# Altium project DD2090_4CAM_FFC_R2M1E2.PrjPcb (part 4 of 5)

## Sheet DD2090_4CAM_FFC_MIPI_4LANE_CAM.SchDoc: =project_title
size Tabloid; PageSetup: Record=PageOptions|CenterHorizontal=True|CenterVertical=True|PrintScale=0.73|XCorrection=1.00|YCorrection=1.00|PrintKind=0|BorderSize=5000000|LeftOffset=0|BottomOffset=0|Orientation=2|PaperLength=1000|PaperWidth=1000|Scale=100|PaperSource=7|PrintQuality=-4|MediaType=1|DitherType=10|PaperKind=A4|PrintScaleMode=1; CompanyName: Luxonis Holding; DrawnBy: Dan Dunga; Organization: Luxonis Holding; Address1: 1925 Harmony Park Drive; Address2: Westminster, CO; Address3: 80234; Address4: United States; DocumentNumber: D0000190; SheetNumber: 6; SheetTotal: 12
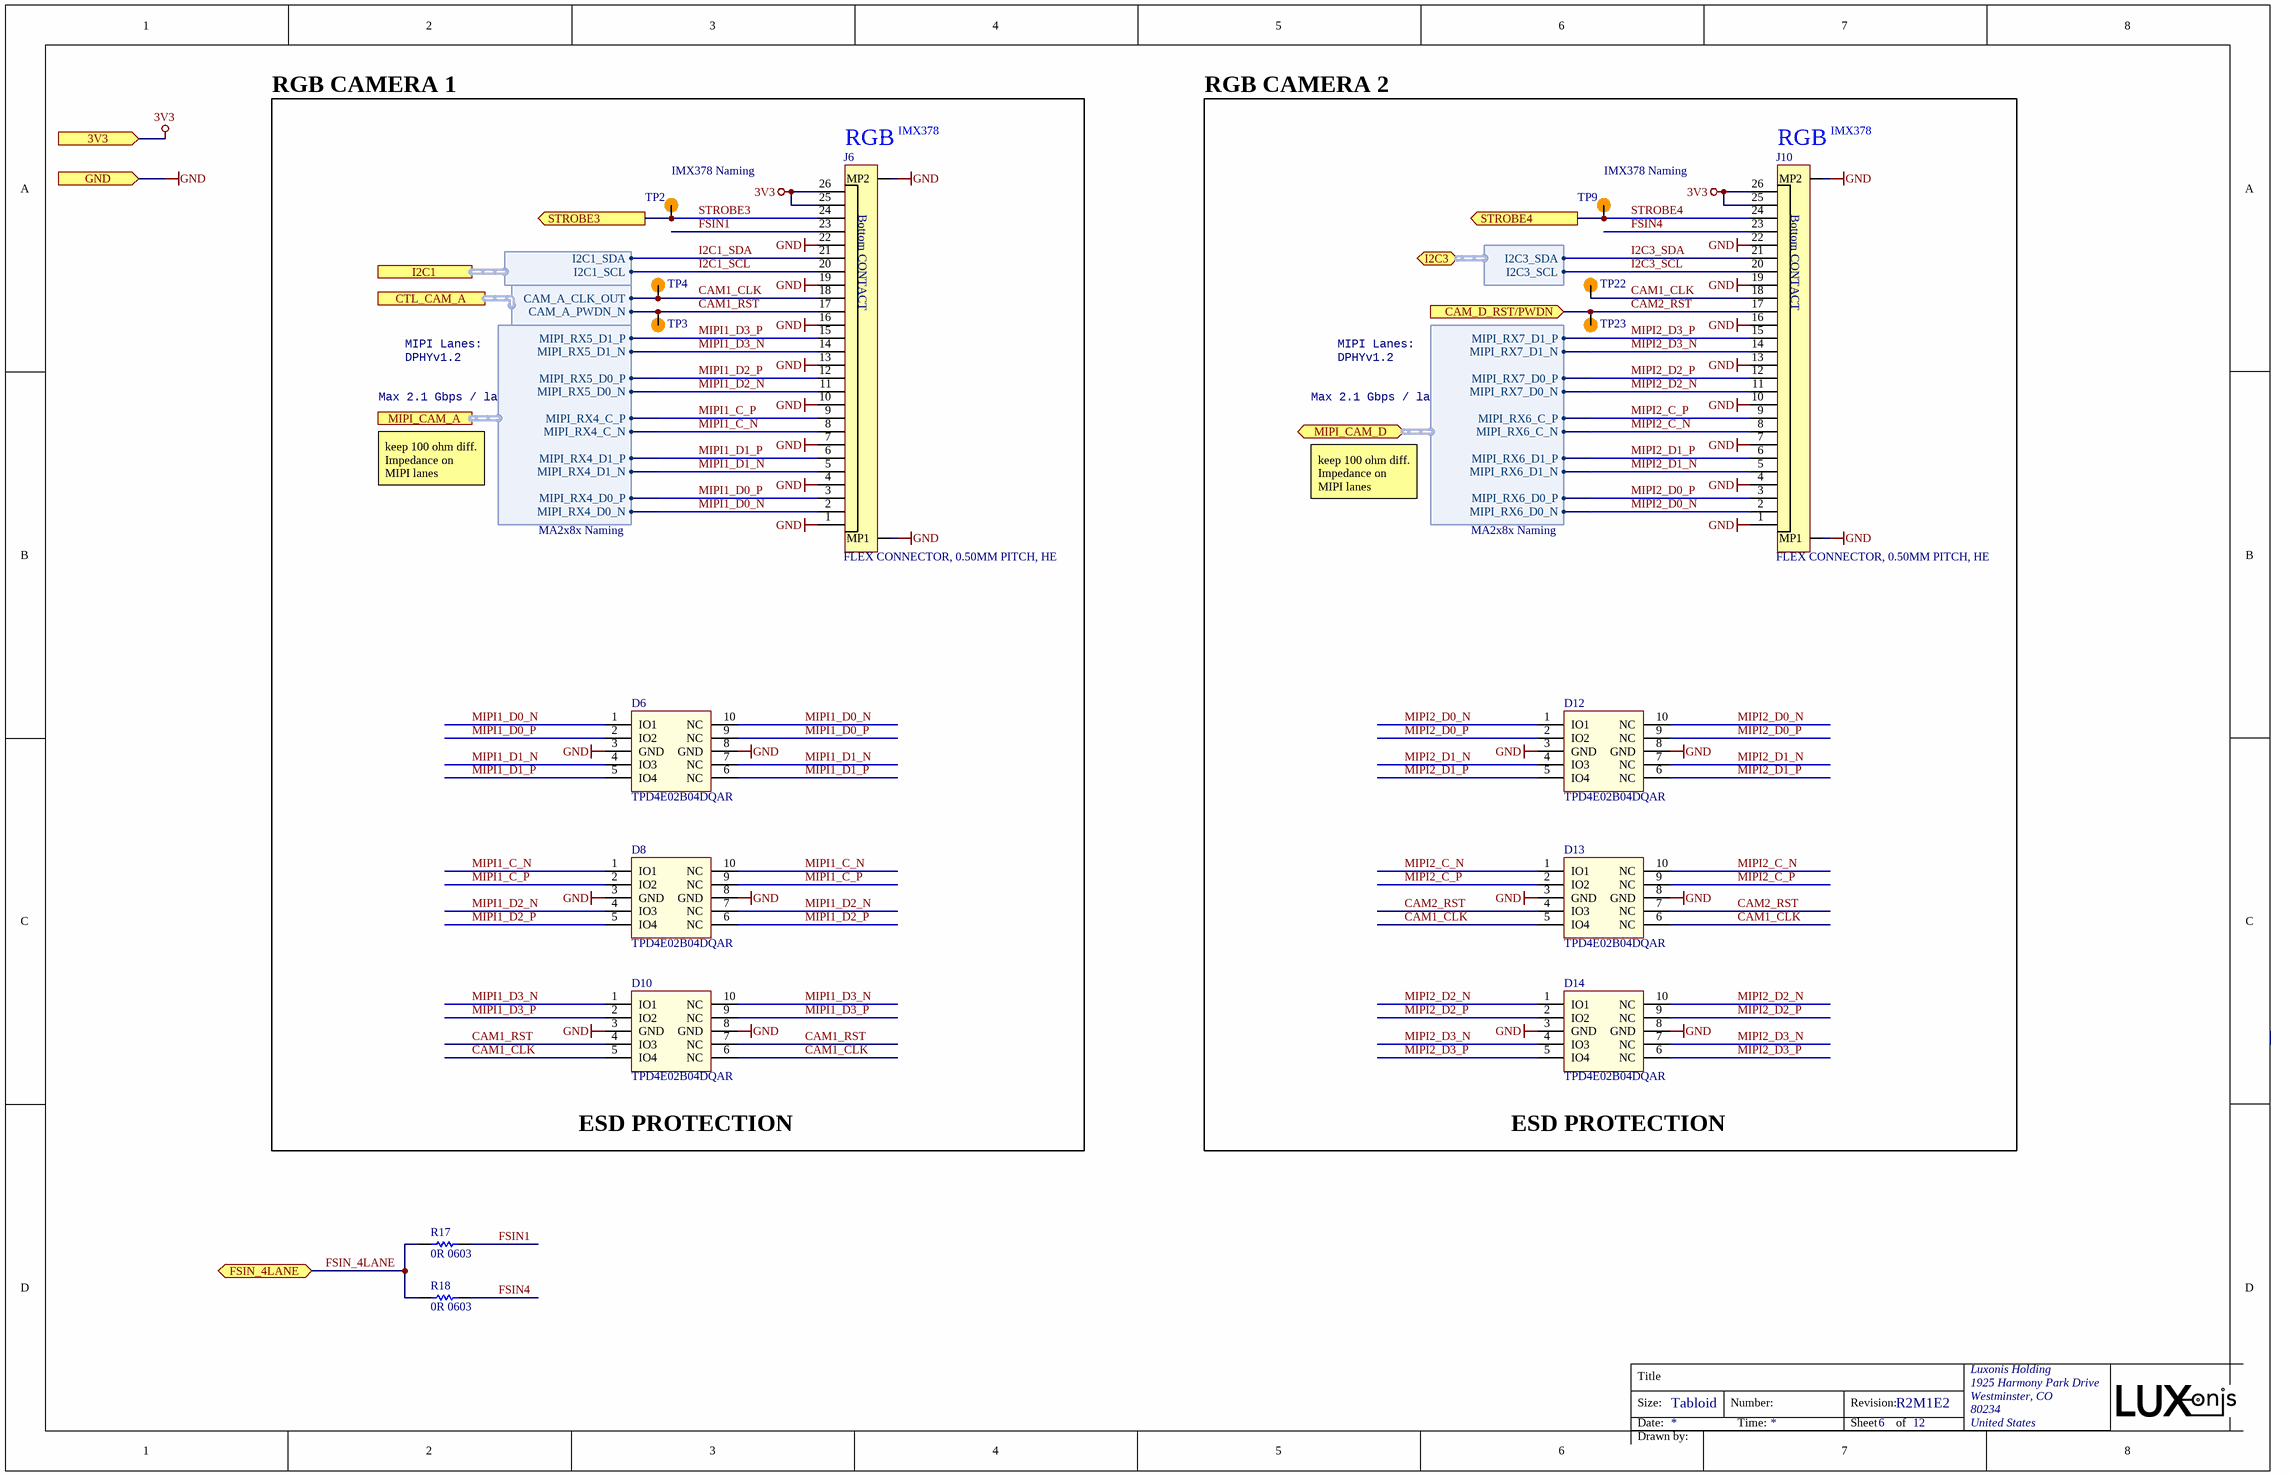
[diagram p7: DD2090_4CAM_FFC_MIPI_4LANE_CAM.SchDoc]

### Parts
D6  TPD4E02B04DQAR  [TPD4E02B04DQAR]
D8  TPD4E02B04DQAR  [TPD4E02B04DQAR]
D10  TPD4E02B04DQAR  [TPD4E02B04DQAR]
D12  TPD4E02B04DQAR  [TPD4E02B04DQAR]
D13  TPD4E02B04DQAR  [TPD4E02B04DQAR]
D14  TPD4E02B04DQAR  [TPD4E02B04DQAR]
J6  FLEX CONNECTOR, 0.50MM PITCH, HE  [F32R-1A7H1-11026]
J10  FLEX CONNECTOR, 0.50MM PITCH, HE  [F32R-1A7H1-11026]
R17  0R 0603  [RESC0603(1608)_N]
R18  0R 0603  [RESC0603(1608)_N]
TP2  TP100_200_NS  [TP100_200_NS]  (value not drawn)  (no BOM)
TP3  TP100_200_NS  [TP100_200_NS]  (value not drawn)  (no BOM)
TP4  TP100_200_NS  [TP100_200_NS]  (value not drawn)  (no BOM)
TP9  TP100_200_NS  [TP100_200_NS]  (value not drawn)  (no BOM)
TP22  TP100_200_NS  [TP100_200_NS]  (value not drawn)  (no BOM)
TP23  TP100_200_NS  [TP100_200_NS]  (value not drawn)  (no BOM)

### Ports
3V3 (in), CAM_D_RST/PWDN (in), CTL_CAM_A (harness CTL_CAM_A), FSIN_4LANE (bidir), GND (in), I2C1 (harness I2C1), I2C3 (bidir, harness I2C3), MIPI_CAM_A (harness MIPI_CAM_A), MIPI_CAM_D (bidir, harness MIPI_CAM_D), STROBE3 (out), STROBE4 (out)

### Harnesses
I2C1: I2C1_SDA, I2C1_SCL
MIPI_CAM_A: MIPI_RX5_D0_P, MIPI_RX5_D0_N, MIPI_RX4_D0_P, MIPI_RX4_D0_N, MIPI_RX4_C_P, MIPI_RX4_C_N, MIPI_RX4_D1_N, MIPI_RX4_D1_P, MIPI_RX5_D1_P, MIPI_RX5_D1_N
CTL_CAM_A: CAM_A_PWDN_N, CAM_A_CLK_OUT
MIPI_CAM_D: MIPI_RX6_C_N, MIPI_RX6_C_P, MIPI_RX6_D0_N, MIPI_RX6_D0_P, MIPI_RX6_D1_N, MIPI_RX6_D1_P, MIPI_RX7_D0_N, MIPI_RX7_D0_P, MIPI_RX7_D1_N, MIPI_RX7_D1_P
I2C3: I2C3_SCL, I2C3_SDA

### Nets
3V3: J6.25 J6.26 J10.25 J10.26 ; port 3V3
GND: D6.3(GND) D6.8(GND) D8.3(GND) D8.8(GND) D10.3(GND) D10.8(GND) D12.3(GND) D12.8(GND) D13.3(GND) D13.8(GND) D14.3(GND) D14.8(GND) J6.1 J6.4 J6.7 J6.10 J6.13 J6.16 J6.19 J6.22 J6.MP1 J6.MP2 J10.1 J10.4 J10.7 J10.10 J10.13 J10.16 J10.19 J10.22 J10.MP1 J10.MP2 ; port GND
CAM1_CLK: D10.5(IO4) D10.6(NC) D13.5(IO4) D13.6(NC) J6.18 J10.18 TP4.1 TP22.1 ; port CTL_CAM_A.CAM_A_CLK_OUT
CAM1_RST: D10.4(IO3) D10.7(NC) J6.17 TP3.1 ; port CTL_CAM_A.CAM_A_PWDN_N
CAM2_RST: D13.4(IO3) D13.7(NC) J10.17 TP23.1 ; port CAM_D_RST/PWDN
FSIN1: J6.23 R17.2
FSIN4: J10.23 R18.2
FSIN_4LANE: R17.1 R18.1 ; port FSIN_4LANE
I2C1_SCL: J6.20 ; port I2C1.I2C1_SCL
I2C1_SDA: J6.21 ; port I2C1.I2C1_SDA
I2C3_SCL: J10.20 ; port I2C3.I2C3_SCL
I2C3_SDA: J10.21 ; port I2C3.I2C3_SDA
MIPI1_C_N: D8.1(IO1) D8.10(NC) J6.8 ; port MIPI_CAM_A.MIPI_RX4_C_N
MIPI1_C_P: D8.2(IO2) D8.9(NC) J6.9 ; port MIPI_CAM_A.MIPI_RX4_C_P
MIPI1_D0_N: D6.1(IO1) D6.10(NC) J6.2 ; port MIPI_CAM_A.MIPI_RX4_D0_N
MIPI1_D0_P: D6.2(IO2) D6.9(NC) J6.3 ; port MIPI_CAM_A.MIPI_RX4_D0_P
MIPI1_D1_N: D6.4(IO3) D6.7(NC) J6.5 ; port MIPI_CAM_A.MIPI_RX4_D1_N
MIPI1_D1_P: D6.5(IO4) D6.6(NC) J6.6 ; port MIPI_CAM_A.MIPI_RX4_D1_P
MIPI1_D2_N: D8.4(IO3) D8.7(NC) J6.11 ; port MIPI_CAM_A.MIPI_RX5_D0_N
MIPI1_D2_P: D8.5(IO4) D8.6(NC) J6.12 ; port MIPI_CAM_A.MIPI_RX5_D0_P
MIPI1_D3_N: D10.1(IO1) D10.10(NC) J6.14 ; port MIPI_CAM_A.MIPI_RX5_D1_N
MIPI1_D3_P: D10.2(IO2) D10.9(NC) J6.15 ; port MIPI_CAM_A.MIPI_RX5_D1_P
MIPI2_C_N: D13.1(IO1) D13.10(NC) J10.8 ; port MIPI_CAM_D.MIPI_RX6_C_N
MIPI2_C_P: D13.2(IO2) D13.9(NC) J10.9 ; port MIPI_CAM_D.MIPI_RX6_C_P
MIPI2_D0_N: D12.1(IO1) D12.10(NC) J10.2 ; port MIPI_CAM_D.MIPI_RX6_D0_N
MIPI2_D0_P: D12.2(IO2) D12.9(NC) J10.3 ; port MIPI_CAM_D.MIPI_RX6_D0_P
MIPI2_D1_N: D12.4(IO3) D12.7(NC) J10.5 ; port MIPI_CAM_D.MIPI_RX6_D1_N
MIPI2_D1_P: D12.5(IO4) D12.6(NC) J10.6 ; port MIPI_CAM_D.MIPI_RX6_D1_P
MIPI2_D2_N: D14.1(IO1) D14.10(NC) J10.11 ; port MIPI_CAM_D.MIPI_RX7_D0_N
MIPI2_D2_P: D14.2(IO2) D14.9(NC) J10.12 ; port MIPI_CAM_D.MIPI_RX7_D0_P
MIPI2_D3_N: D14.4(IO3) D14.7(NC) J10.14 ; port MIPI_CAM_D.MIPI_RX7_D1_N
MIPI2_D3_P: D14.5(IO4) D14.6(NC) J10.15 ; port MIPI_CAM_D.MIPI_RX7_D1_P
STROBE3: J6.24 TP2.1 ; port STROBE3
STROBE4: J10.24 TP9.1 ; port STROBE4

### Notes on the sheet
- RGB CAMERA 1
- RGB CAMERA 2
- (near J6) RGB
- (near J6) IMX378
- (near J10) RGB
- (near J10) IMX378
- (near TP2) IMX378 Naming
- (near TP9) IMX378 Naming
- MIPI Lanes:
- DPHYv1.2
- Max 2.1 Gbps / lane
- keep 100 ohm diff. Impedance on MIPI lanes
- MA2x8x Naming
- ESD PROTECTION
- Title
- Size:
- Date:
- Tabloid
- Number:
- Time:
- Revision:
- Sheet
- of
- Drawn by:
- (in symbol F32R-1A7H1-11026) Bottom CONTACT

### Library data of the parts
D6 D8 D10 D12-D14 = TPD4E02B04DQAR: TVS DIODE 3.6V 8.8V 10USON 8.8V (Typ) Clamp 5A (8/20µs) Ipp Tvs Diode Surface Mount 10-USON (2.5x1); Manufacturer 1: Texas Instruments; Number of Bidirectional Channels: 4; Min Breakdown Voltage: 5.5V; Peak Pulse Power: 17W; Power Line Protection: No; Interface: USB,HDMI; Supplier 1: Digi-Key; Manufacturer Part Number 1: TPD4E02B04DQAR; Stock 1: 25615; Pricing 1: 1=0.69000, 10=0.60800, 100=0.46650, 500=0.36874, 1000=0.29499 (USD); RoHS: Yes; Mount: Surface Mount; Number of Pins: 10; Min Operating Temperature: -40°C; Max Operating Temperature: 125°C; Packaging: Cut Tape; Reverse Standoff Voltage: 3.6V; Clamping Voltage: 8.8V; Operating Supply Voltage: 3.6V; Peak Pulse Current: 5A; Number of Channels: 4; Composition: Zener; REACH SVHC: No SVHC; Lead Free: Lead Free; ComponentLink1URL: http://www.ti.com/general/docs/lit/getliterature.tsp?genericPartNumber=TPD4E02B04&amp;&amp;fileType=pdf&src-supplier=Element14; ComponentLink1Description: http://www.ti.com/general/docs/lit/getliterature.tsp?genericPartNumber=TPD4E02B04&amp;&amp;fileType=pdf&src-supplier=Element14; ComponentLink2URL: http://www.ti.com/lit/ds/symlink/tpd4e02b04.pdf?src-supplier=Farnell; ComponentLink2Description: http://www.ti.com/lit/ds/symlink/tpd4e02b04.pdf?src-supplier=Farnell; ComponentLink3URL: http://www.ti.com/lit/ds/symlink/tpd4e02b04.pdf?src-supplier=Newark; ComponentLink3Description: http://www.ti.com/lit/ds/symlink/tpd4e02b04.pdf?src-supplier=Newark; ComponentLink4URL: http://www.ti.com/lit/ds/symlink/tpd4e02b04.pdf?src-supplier=Digi-Key; ComponentLink4Description: http://www.ti.com/lit/ds/symlink/tpd4e02b04.pdf?src-supplier=Digi-Key; Supplier Part Number 1: 296-43875-1-ND
J6 J10 = F32R-1A7H1-11026: 26 Position FFC, FPC Connector Contacts, Bottom 0.020" (0.50mm) Surface Mount, Right Angle; Manufacturer 1: Amphenol ICC (FCI); Number of Positions: 26; Voltage Rating: 50V; Current Rating: 500mA; Pitch: 0.02inch; Supplier 1: Digi-Key; Manufacturer Part Number 1: F32R-1A7H1-11026; RoHS: Yes; Category: Connectors; Pricing 1: 1=0.77, 10=0.721, 100=0.5529, 500=0.4808 (USD); Mount: Surface Mount; Contact Plating: Tin; Contact Material: Bronze; Min Operating Temperature: -40°C; Max Operating Temperature: 105°C; Packaging: Tape and Reel; Termination: Solder; Flammability Rating: UL94 V-0; ComponentLink1URL: https://cdn.amphenol-icc.com/media/wysiwyg/files/drawing/f32r-f32j.pdf; ComponentLink1Description: https://cdn.amphenol-icc.com/media/wysiwyg/files/drawing/f32r-f32j.pdf; Stock 1: 1709; Supplier Part Number 1: 609-F32R-1A7H1-11026CT-ND
R17 R18 = CRCW06030000Z0EA: as R6 on sheet DD2090_4CAM_FFC_Power_Supply; Supplier 1: Digi-Key; Stock 1: 742743; Pricing 1: 1=0.100000, 10=0.034000, 25=0.024400, 50=0.018600, 100=0.013800, 250=0.010480, 500=0.008400, 1000=0.006180 (USD); RoHS: Yes; Mount: Surface Mount; Case/Package: 0603; Weight: 7.1E-05oz; Contact Plating: Tin,Lead; Case Code (Metric): 1608; Case Code (Imperial): 0603; Min Operating Temperature: -55°C; Max Operating Temperature: 155°C; Composition: Thick Film; Termination: SMD/SMT; Packaging: Tape and Reel; Package Quantity: 1; Number of Terminations: 2; Military Standard: Not; Max Power Dissipation: 100mW; Voltage Rating (DC): 75V; Features: Automotive AEC-Q200; Working Voltage: 75V; Length: 1.55mm; Height: 0.02inch; Width: 0.033inch; Depth: 0.85mm; Radiation Hardening: No; Lead Free: Lead Free; REACH SVHC: Unknown; ComponentLink1URL: https://datasheet.ciiva.com/2461/dcrcwe3-2461968.pdf?src-supplier=Digi-Key; ComponentLink1Description: https://datasheet.ciiva.com/2461/dcrcwe3-2461968.pdf?src-supplier=Digi-Key; ComponentLink2URL: https://datasheet.ciiva.com/2461/dcrcwe3-2461969.pdf?src-supplier=Digi-Key; ComponentLink2Description: https://datasheet.ciiva.com/2461/dcrcwe3-2461969.pdf?src-supplier=Digi-Key; ComponentLink3URL: https://datasheet.ciiva.com/2461/dcrcwe3-2461970.pdf?src-supplier=Digi-Key; ComponentLink3Description: https://datasheet.ciiva.com/2461/dcrcwe3-2461970.pdf?src-supplier=Digi-Key; ComponentLink4URL: https://datasheet.ciiva.com/8340/dcrcwe3-8340197.pdf?src-supplier=Avnet; ComponentLink4Description: https://datasheet.ciiva.com/8340/dcrcwe3-8340197.pdf?src-supplier=Avnet; ComponentLink5URL: https://datasheet.ciiva.com/16941/dcrcw-16941302.pdf?src-supplier=Avnet+Europe; ComponentLink5Description: https://datasheet.ciiva.com/16941/dcrcw-16941302.pdf?src-supplier=Avnet+Europe; ComponentLink6URL: https://datasheet.ciiva.com/16199/dcrcwe3-16199063.pdf?src-supplier=Future+Electronics; ComponentLink6Description: https://datasheet.ciiva.com/16199/dcrcwe3-16199063.pdf?src-supplier=Future+Electronics; ComponentLink7URL: https://datasheet.ciiva.com/16725/70201119-16725175.pdf?src-supplier=Allied+Electronics; ComponentLink7Description: https://datasheet.ciiva.com/16725/70201119-16725175.pdf?src-supplier=Allied+Electronics; ComponentLink8URL: https://datasheet.ciiva.com/26316/fld-crcw-e3-data-en-26316615.pdf?src-supplier=Distrelec; ComponentLink8Description: https://datasheet.ciiva.com/26316/fld-crcw-e3-data-en-26316615.pdf?src-supplier=Distrelec; ComponentLink9URL: https://datasheet.ciiva.com/5544/dcrcwe3-109170-5544344.pdf?src-supplier=Mouser; ComponentLink9Description: https://datasheet.ciiva.com/5544/dcrcwe3-109170-5544344.pdf?src-supplier=Mouser; ComponentLink10URL: https://datasheet.ciiva.com/7841/1720486-7841816.pdf?src-supplier=Element14; ComponentLink10Description: https://datasheet.ciiva.com/7841/1720486-7841816.pdf?src-supplier=Element14; ComponentLink11URL: https://datasheet.ciiva.com/7841/1720486-7841817.pdf?src-supplier=Element14; ComponentLink11Description: https://datasheet.ciiva.com/7841/1720486-7841817.pdf?src-supplier=Element14; ComponentLink12URL: https://datasheet.ciiva.com/7841/125364-7841818.pdf?src-supplier=Element14; ComponentLink12Description: https://datasheet.ciiva.com/7841/125364-7841818.pdf?src-supplier=Element14; ComponentLink13URL: https://datasheet.ciiva.com/16721/70201119-16721450.pdf?src-supplier=Allied+Electronics; ComponentLink13Description: https://datasheet.ciiva.com/16721/70201119-16721450.pdf?src-supplier=Allied+Electronics; Supplier Part Number 1: 541-0.0GCT-ND
TP2-TP4 TP9 TP22 TP23 = TEST_POINT

## Sheet DD2090_4CAM_FFC_Connector_A.SchDoc: =project_title
size Tabloid; CompanyName: Luxonis Holding; DrawnBy: Dan Dunga; Organization: Luxonis Holding; Address1: 1925 Harmony Park Drive; Address2: Westminster, CO; Address3: 80234; Address4: United States; DocumentNumber: D0000190; SheetNumber: 3; SheetTotal: 12
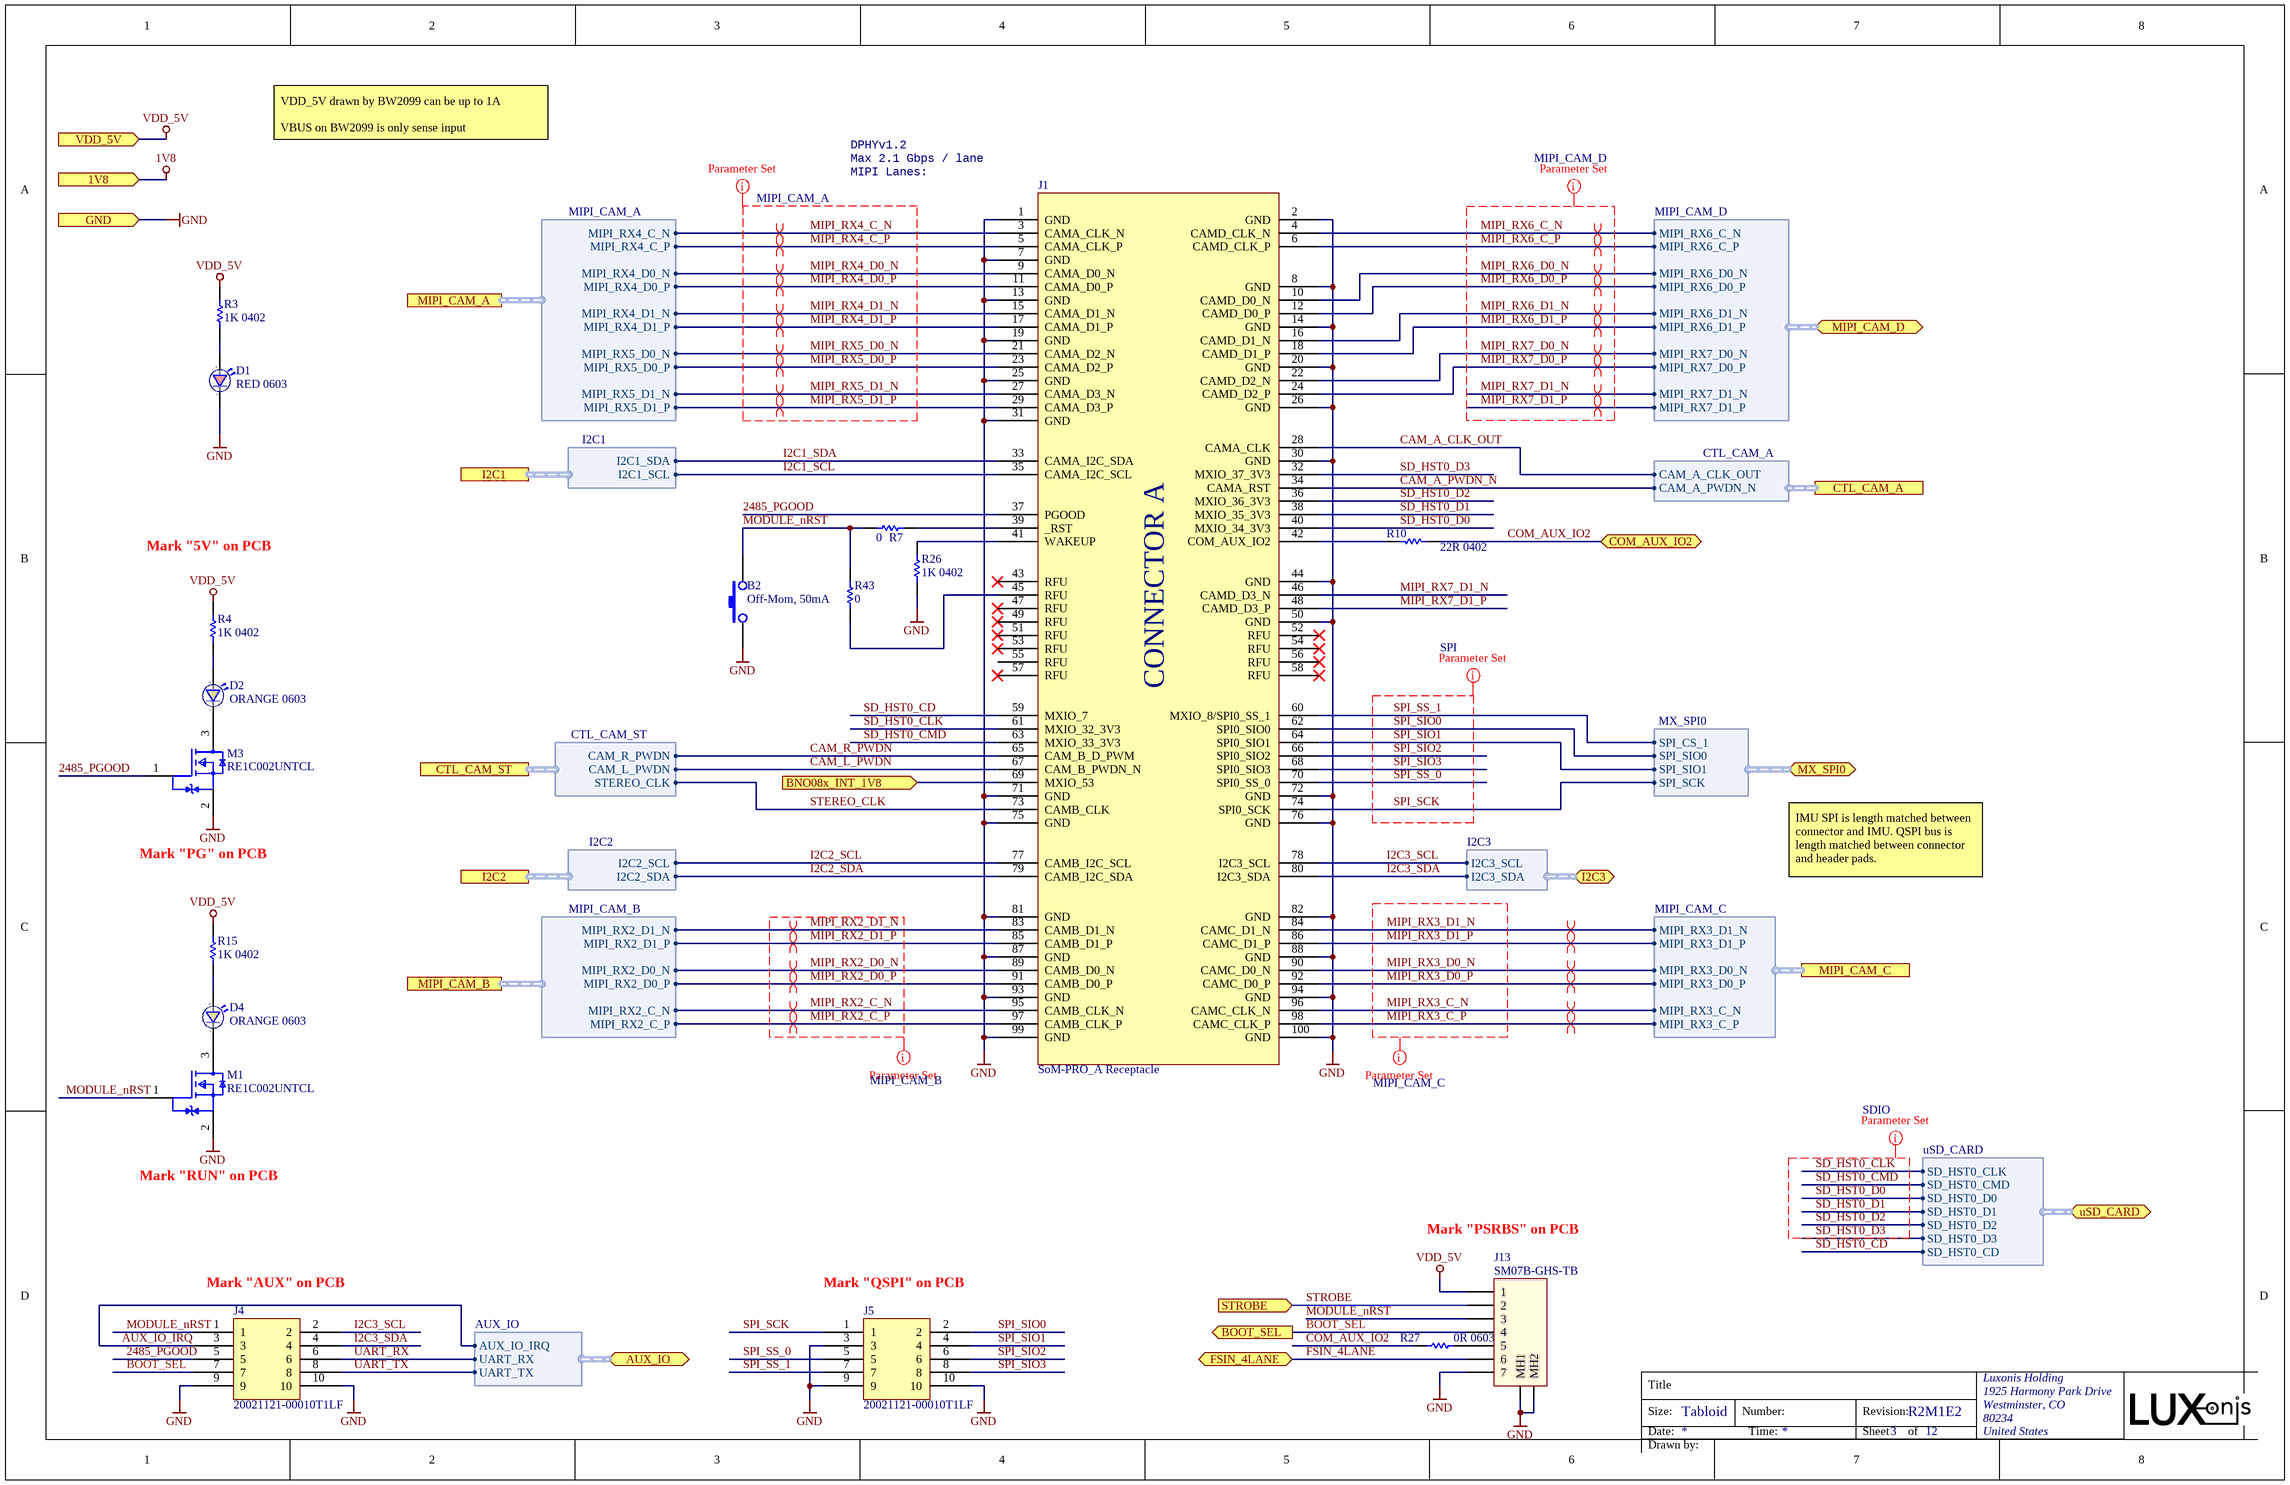
[diagram p8: DD2090_4CAM_FFC_Connector_A.SchDoc]

### Parts
B2  Off-Mom, 50mA  [DTSM-32N-V]
D1  RED 0603  [SML_D1xx8W]
D2  ORANGE 0603  [SML_D1xx8W]
D4  ORANGE 0603  [SML_D1xx8W]
J1  SoM-PRO_A Receptacle  [CON_A_BW2099_SoM_DF40HC-3.0-100DS-0.4V_minpad]
J4  20021121-00010T1LF  [20021121-00010T1LF]
J5  20021121-00010T1LF  [20021121-00010T1LF]
J13  SM07B-GHS-TB  [SM07B-GHS-TB]
M1  RE1C002UNTCL  [RE1C002UNTCL]
M3  RE1C002UNTCL  [RE1C002UNTCL]
R3  1K 0402  [RESC0402(1005)_N]
R4  1K 0402  [RESC0402(1005)_N]
R7  value 0  [RESC0402(1005)_L]  (hidden comment: CRCW04020000Z0ED)
R10  22R 0402  [RESC0402(1005)_N]
R15  1K 0402  [RESC0402(1005)_N]
R26  1K 0402  [RESC0402(1005)_N]
R27  0R 0603  [RESC0603(1608)_N]
R43  value 0  [RESC0402(1005)_L]  (hidden comment: CRCW04020000Z0ED)

### Ports
1V8 (in), AUX_IO (bidir, harness AUX_IO), BNO08x_INT_1V8 (in), BOOT_SEL (out), COM_AUX_IO2 (bidir), CTL_CAM_A (harness CTL_CAM_A), CTL_CAM_ST (harness CTL_CAM_ST), FSIN_4LANE (bidir), GND (in), I2C1 (harness I2C1), I2C2 (harness I2C2), I2C3 (bidir, harness I2C3), MIPI_CAM_A (harness MIPI_CAM_A), MIPI_CAM_B (harness MIPI_CAM_B), MIPI_CAM_C (harness MIPI_CAM_C), MIPI_CAM_D (bidir, harness MIPI_CAM_D), MX_SPI0 (bidir, harness MX_SPI0), STROBE (in), uSD_CARD (bidir, harness uSD_CARD), VDD_5V (in)

### Harnesses
MIPI_CAM_A: MIPI_RX4_C_P, MIPI_RX4_C_N, MIPI_RX4_D0_P, MIPI_RX4_D0_N, MIPI_RX4_D1_P, MIPI_RX4_D1_N, MIPI_RX5_D0_P, MIPI_RX5_D0_N, MIPI_RX5_D1_P, MIPI_RX5_D1_N
I2C1: I2C1_SDA, I2C1_SCL
MIPI_CAM_B: MIPI_RX2_C_P, MIPI_RX2_C_N, MIPI_RX2_D0_P, MIPI_RX2_D0_N, MIPI_RX2_D1_P, MIPI_RX2_D1_N
MIPI_CAM_C: MIPI_RX3_C_P, MIPI_RX3_C_N, MIPI_RX3_D0_P, MIPI_RX3_D0_N, MIPI_RX3_D1_P, MIPI_RX3_D1_N
MX_SPI0: SPI_SIO0, SPI_SIO1, SPI_CS_1, SPI_SCK
CTL_CAM_A: CAM_A_PWDN_N, CAM_A_CLK_OUT
MIPI_CAM_D: MIPI_RX6_C_N, MIPI_RX6_C_P, MIPI_RX6_D0_N, MIPI_RX6_D0_P, MIPI_RX6_D1_N, MIPI_RX6_D1_P, MIPI_RX7_D0_N, MIPI_RX7_D0_P, MIPI_RX7_D1_N, MIPI_RX7_D1_P
uSD_CARD: SD_HST0_CLK, SD_HST0_CMD, SD_HST0_D0, SD_HST0_D1, SD_HST0_D2, SD_HST0_D3, SD_HST0_CD
I2C2: I2C2_SDA, I2C2_SCL
I2C3: I2C3_SCL, I2C3_SDA
AUX_IO: AUX_IO_IRQ, UART_TX, UART_RX
CTL_CAM_ST: CAM_L_PWDN, STEREO_CLK, CAM_R_PWDN

### Nets
GND: B2.1 D1.1(C) J1.1(GND) J1.2(GND) J1.7(GND) J1.8(GND) J1.13(GND) J1.14(GND) J1.19(GND) J1.20(GND) J1.25(GND) J1.26(GND) J1.30(GND) J1.31(GND) J1.44(GND) J1.50(GND) J1.71(GND) J1.72(GND) J1.75(GND) J1.76(GND) J1.81(GND) J1.82(GND) J1.87(GND) J1.88(GND) J1.93(GND) J1.94(GND) J1.99(GND) J1.100(GND) J4.9 J4.10 J5.3 J5.9 J5.10 J13.7 J13.MH1 J13.MH2 M1.2(Source) M3.2(Source) R26.1 ; port GND
VDD_5V: J13.1 R3.2 R4.2 R15.2 ; port VDD_5V
2485_PGOOD: J1.37(PGOOD) J4.5 M3.1(Gate)
AUX_IO_IRQ: J4.3 ; port AUX_IO.AUX_IO_IRQ
BNO08x_INT_1V8: J1.69(MXIO_53) ; port BNO08x_INT_1V8
BOOT_SEL: J4.7 J13.4 ; port BOOT_SEL
CAM_A_CLK_OUT: J1.28(CAMA_CLK) ; port CTL_CAM_A.CAM_A_CLK_OUT  [project net CAM1_CLK]
CAM_A_PWDN_N: J1.34(CAMA_RST) ; port CTL_CAM_A.CAM_A_PWDN_N  [project net CAM1_RST]
CAM_L_PWDN: J1.67(CAM_B_PWDN_N) ; port CTL_CAM_ST.CAM_L_PWDN
CAM_R_PWDN: J1.65(CAM_B_D_PWM) ; port CTL_CAM_ST.CAM_R_PWDN
COM_AUX_IO2: R10.1 R27.1 ; port COM_AUX_IO2
FSIN_4LANE: J13.6 ; port FSIN_4LANE
I2C1_SCL: J1.35(CAMA_I2C_SCL) ; port I2C1.I2C1_SCL
I2C1_SDA: J1.33(CAMA_I2C_SDA) ; port I2C1.I2C1_SDA
I2C2_SCL: J1.77(CAMB_I2C_SCL) ; port I2C2.I2C2_SCL
I2C2_SDA: J1.79(CAMB_I2C_SDA) ; port I2C2.I2C2_SDA
I2C3_SCL: J1.78(I2C3_SCL) J4.2 ; port I2C3.I2C3_SCL
I2C3_SDA: J1.80(I2C3_SDA) J4.4 ; port I2C3.I2C3_SDA
MIPI_RX2_C_N: J1.95(CAMB_CLK_N) ; port MIPI_CAM_B.MIPI_RX2_C_N  [project net CAM_L_C_N]
MIPI_RX2_C_P: J1.97(CAMB_CLK_P) ; port MIPI_CAM_B.MIPI_RX2_C_P  [project net CAM_L_C_P]
MIPI_RX2_D0_N: J1.89(CAMB_D0_N) ; port MIPI_CAM_B.MIPI_RX2_D0_N  [project net CAM_L_D0_N]
MIPI_RX2_D0_P: J1.91(CAMB_D0_P) ; port MIPI_CAM_B.MIPI_RX2_D0_P  [project net CAM_L_D0_P]
MIPI_RX2_D1_N: J1.83(CAMB_D1_N) ; port MIPI_CAM_B.MIPI_RX2_D1_N  [project net CAM_L_D1_N]
MIPI_RX2_D1_P: J1.85(CAMB_D1_P) ; port MIPI_CAM_B.MIPI_RX2_D1_P  [project net CAM_L_D1_P]
MIPI_RX3_C_N: J1.96(CAMC_CLK_N) ; port MIPI_CAM_C.MIPI_RX3_C_N  [project net CAM_R_C_N]
MIPI_RX3_C_P: J1.98(CAMC_CLK_P) ; port MIPI_CAM_C.MIPI_RX3_C_P  [project net CAM_R_C_P]
MIPI_RX3_D0_N: J1.90(CAMC_D0_N) ; port MIPI_CAM_C.MIPI_RX3_D0_N  [project net CAM_R_D0_N]
MIPI_RX3_D0_P: J1.92(CAMC_D0_P) ; port MIPI_CAM_C.MIPI_RX3_D0_P  [project net CAM_R_D0_P]
MIPI_RX3_D1_N: J1.84(CAMC_D1_N) ; port MIPI_CAM_C.MIPI_RX3_D1_N  [project net CAM_R_D1_N]
MIPI_RX3_D1_P: J1.86(CAMC_D1_P) ; port MIPI_CAM_C.MIPI_RX3_D1_P  [project net CAM_R_D1_P]
MIPI_RX4_C_N: J1.3(CAMA_CLK_N) ; port MIPI_CAM_A.MIPI_RX4_C_N  [project net MIPI1_C_N]
MIPI_RX4_C_P: J1.5(CAMA_CLK_P) ; port MIPI_CAM_A.MIPI_RX4_C_P  [project net MIPI1_C_P]
MIPI_RX4_D0_N: J1.9(CAMA_D0_N) ; port MIPI_CAM_A.MIPI_RX4_D0_N  [project net MIPI1_D0_N]
MIPI_RX4_D0_P: J1.11(CAMA_D0_P) ; port MIPI_CAM_A.MIPI_RX4_D0_P  [project net MIPI1_D0_P]
MIPI_RX4_D1_N: J1.15(CAMA_D1_N) ; port MIPI_CAM_A.MIPI_RX4_D1_N  [project net MIPI1_D1_N]
MIPI_RX4_D1_P: J1.17(CAMA_D1_P) ; port MIPI_CAM_A.MIPI_RX4_D1_P  [project net MIPI1_D1_P]
MIPI_RX5_D0_N: J1.21(CAMA_D2_N) ; port MIPI_CAM_A.MIPI_RX5_D0_N  [project net MIPI1_D2_N]
MIPI_RX5_D0_P: J1.23(CAMA_D2_P) ; port MIPI_CAM_A.MIPI_RX5_D0_P  [project net MIPI1_D2_P]
MIPI_RX5_D1_N: J1.27(CAMA_D3_N) ; port MIPI_CAM_A.MIPI_RX5_D1_N  [project net MIPI1_D3_N]
MIPI_RX5_D1_P: J1.29(CAMA_D3_P) ; port MIPI_CAM_A.MIPI_RX5_D1_P  [project net MIPI1_D3_P]
MIPI_RX6_C_N: J1.4(CAMD_CLK_N) ; port MIPI_CAM_D.MIPI_RX6_C_N  [project net MIPI2_C_N]
MIPI_RX6_C_P: J1.6(CAMD_CLK_P) ; port MIPI_CAM_D.MIPI_RX6_C_P  [project net MIPI2_C_P]
MIPI_RX6_D0_N: J1.10(CAMD_D0_N) ; port MIPI_CAM_D.MIPI_RX6_D0_N  [project net MIPI2_D0_N]
MIPI_RX6_D0_P: J1.12(CAMD_D0_P) ; port MIPI_CAM_D.MIPI_RX6_D0_P  [project net MIPI2_D0_P]
MIPI_RX6_D1_N: J1.16(CAMD_D1_N) ; port MIPI_CAM_D.MIPI_RX6_D1_N  [project net MIPI2_D1_N]
MIPI_RX6_D1_P: J1.18(CAMD_D1_P) ; port MIPI_CAM_D.MIPI_RX6_D1_P  [project net MIPI2_D1_P]
MIPI_RX7_D0_N: J1.22(CAMD_D2_N) ; port MIPI_CAM_D.MIPI_RX7_D0_N  [project net MIPI2_D2_N]
MIPI_RX7_D0_P: J1.24(CAMD_D2_P) ; port MIPI_CAM_D.MIPI_RX7_D0_P  [project net MIPI2_D2_P]
MIPI_RX7_D1_N: J1.46(CAMD_D3_N) ; port MIPI_CAM_D.MIPI_RX7_D1_N  [project net MIPI2_D3_N]
MIPI_RX7_D1_P: J1.48(CAMD_D3_P) ; port MIPI_CAM_D.MIPI_RX7_D1_P  [project net MIPI2_D3_P]
MODULE_nRST: B2.2 J4.1 J13.3 M1.1(Gate) R7.2 R43.2
SD_HST0_CD: J1.59(MXIO_7) ; port uSD_CARD.SD_HST0_CD
SD_HST0_CLK: J1.61(MXIO_32_3V3) ; port uSD_CARD.SD_HST0_CLK
SD_HST0_CMD: J1.63(MXIO_33_3V3) ; port uSD_CARD.SD_HST0_CMD
SD_HST0_D0: J1.40(MXIO_34_3V3) ; port uSD_CARD.SD_HST0_D0
SD_HST0_D1: J1.38(MXIO_35_3V3) ; port uSD_CARD.SD_HST0_D1
SD_HST0_D2: J1.36(MXIO_36_3V3) ; port uSD_CARD.SD_HST0_D2
SD_HST0_D3: J1.32(MXIO_37_3V3) ; port uSD_CARD.SD_HST0_D3
SPI_SCK: J1.74(SPI0_SCK) J5.1 ; port MX_SPI0.SPI_SCK  [project net BNO08x_SCK_1V8]
SPI_SIO0: J1.62(SPI0_SIO0) J5.2 ; port MX_SPI0.SPI_SIO0  [project net BNO08x_COPI_1V8]
SPI_SIO1: J1.64(SPI0_SIO1) J5.4 ; port MX_SPI0.SPI_SIO1  [project net BNO08x_CIPO_1V8]
SPI_SIO2: J1.66(SPI0_SIO2) J5.6
SPI_SIO3: J1.68(SPI0_SIO3) J5.8
SPI_SS_0: J1.70(SPI0_SS_0) J5.5
SPI_SS_1: J1.60(MXIO_8/SPI0_SS_1) J5.7 ; port MX_SPI0.SPI_CS_1  [project net BNO08x_CS_1V8]
STEREO_CLK: J1.73(CAMB_CLK) ; port CTL_CAM_ST.STEREO_CLK
STROBE: J13.2 ; port STROBE
UART_RX: J4.6 ; port AUX_IO.UART_RX
UART_TX: J4.8 ; port AUX_IO.UART_TX
NetD1_2: D1.2(A) R3.1
NetD2_1: D2.1(C) M3.3(Drain)
NetD2_2: D2.2(A) R4.1
NetD4_1: D4.1(C) M1.3(Drain)
NetD4_2: D4.2(A) R15.1
NetJ1_39: J1.39(_RST) R7.1
NetJ1_41: J1.41(WAKEUP) R26.2
NetJ1_42: J1.42(COM_AUX_IO2) R10.2
NetJ1_45: J1.45(RFU) R43.1
NetJ13_5: J13.5 R27.2

Not connected (* = marked no-connect by the designer): J1 43(RFU)* 47(RFU)* 49(RFU)* 51(RFU)* 52(RFU)* 53(RFU)* 54(RFU)* 55(RFU) 56(RFU)* 57(RFU)* 58(RFU)*

### Layout directives
net class MIPI_CAM_A; rule Matched Net Lengths [Delay Tolerance = 1ps]; rule Matched Net Lengths [Delay Tolerance = 0,5ps]: MIPI_RX4_C_N, MIPI_RX4_C_P, MIPI_RX4_D0_N, MIPI_RX4_D0_P, MIPI_RX4_D1_N, MIPI_RX4_D1_P, MIPI_RX5_D0_N, MIPI_RX5_D0_P, MIPI_RX5_D1_N, MIPI_RX5_D1_P
differential pair; differential pair class 100ohm: CAM_L_C_N, CAM_L_C_P, CAM_L_D0_N, CAM_L_D0_P, CAM_L_D1_N, CAM_L_D1_P, CAM_R_C_N, CAM_R_C_P, CAM_R_D0_N, CAM_R_D0_P, CAM_R_D1_N, CAM_R_D1_P, MIPI1_C_N, MIPI1_C_P, MIPI1_D0_N, MIPI1_D0_P, MIPI1_D1_N, MIPI1_D1_P, MIPI1_D2_N, MIPI1_D2_P, MIPI1_D3_N, MIPI1_D3_P, MIPI2_C_N, MIPI2_C_P, MIPI2_D0_N, MIPI2_D0_P, MIPI2_D1_N, MIPI2_D1_P, MIPI2_D2_N, MIPI2_D2_P, MIPI2_D3_N, MIPI2_D3_P
net class MIPI_CAM_B; rule Matched Net Lengths [Delay Tolerance = 1ps]; rule Matched Net Lengths [Delay Tolerance = 0,5ps]: MIPI_RX2_C_N, MIPI_RX2_C_P, MIPI_RX2_D0_N, MIPI_RX2_D0_P, MIPI_RX2_D1_N, MIPI_RX2_D1_P
net class MIPI_CAM_C; rule Matched Net Lengths [Delay Tolerance = 1ps]; rule Matched Net Lengths [Delay Tolerance = 0,5ps]: MIPI_RX3_C_N, MIPI_RX3_C_P, MIPI_RX3_D0_N, MIPI_RX3_D0_P, MIPI_RX3_D1_N, MIPI_RX3_D1_P
net class SPI: SPI_SCK, SPI_SIO0, SPI_SIO1, SPI_SIO2, SPI_SIO3, SPI_SS_0, SPI_SS_1
net class SDIO; rule Matched Net Lengths [Tolerance = 100mil]: SD_HST0_CLK, SD_HST0_CMD, SD_HST0_D0, SD_HST0_D1, SD_HST0_D2, SD_HST0_D3
net class MIPI_CAM_D; rule Matched Net Lengths [Delay Tolerance = 1ps]; rule Matched Net Lengths [Delay Tolerance = 0,5ps]: MIPI_RX6_C_N, MIPI_RX6_C_P, MIPI_RX6_D0_N, MIPI_RX6_D0_P, MIPI_RX6_D1_N, MIPI_RX6_D1_P, MIPI_RX7_D0_N, MIPI_RX7_D0_P, MIPI_RX7_D1_N, MIPI_RX7_D1_P

### Notes on the sheet
- VDD_5V drawn by BW2099 can be up to 1A
  VBUS on BW2099 is only sense input
- Max 2.1 Gbps / lane
- DPHYv1.2
- MIPI Lanes:
- Mark "5V" on PCB
- Mark "PG" on PCB
- IMU SPI is length matched between connector and IMU. QSPI bus is length matched between connector and header pads.
- Mark "RUN" on PCB
- Mark "PSRBS" on PCB
- (near J4) Mark "AUX" on PCB
- (near J5) Mark "QSPI" on PCB
- Title
- Size:
- Date:
- Tabloid
- Number:
- Time:
- Revision:
- Sheet
- of
- Drawn by:
- (in symbol DF40HC(3.0)-100DS-0.4V_SoM-PRO_A) CONNECTOR A

### Library data of the parts
B2 = DTSM-32N-V: SWITCH TACTILE SMT 3.5mm * 6mm , brown 160gf; Manufacturer 1: Diptronics; Manufacturer Part Number 1: DTSM-32N-V-T/R; Supplier 1: Mouser; Stock 1: 3199; Pricing 1: 1=0.38000, 10=0.38000, 50=0.31000, 100=0.28200, 500=0.25600, 1000=0.23600, 1600=0.20900, 4800=0.18800, 9600=0.17300, 10000=0.17300, 24000=0.16100 (USD); RoHS: No; Min Operating Temperature: -30°C; Max Operating Temperature: 80°C; Length: 6mm; Height: 5mm; Width: 3.5mm; ComponentLink1URL: https://datasheet.ciiva.com/29188/708548-da-01-en-tastschalter-smd-dtsm-32n-v-tr-1600st-29188823.pdf?src-supplier=Conrad; ComponentLink1Description: https://datasheet.ciiva.com/29188/708548-da-01-en-tastschalter-smd-dtsm-32n-v-tr-1600st-29188823.pdf?src-supplier=Conrad; Supplier Part Number 1: 113-DTSM32NVTR
D1 = SML-D12U8WT86: LED RED DIFFUSED 0603 SMD Red 620nm LED Indication - Discrete 2.2V 0603 (1608 Metric); Manufacturer 1: Rohm; Lens Color: White,Clear,Diffused; Lens Style: Rectangular,Diffused,Colorless; Forward Current: 20mA; Luminous Intensity: 63mcd; Number of LEDs: 1; Viewing Angle: 160°; RoHS: Yes; Mount: Surface Mount; Case/Package: 0603; Number of Pins: 2; Color: Red; Case Code (Metric): 1608; Case Code (Imperial): 0603; Min Operating Temperature: -40°C; Max Operating Temperature: 85°C; Forward Voltage: 2.2V; Packaging: Tape and Reel; Dominant Wavelength: 620nm; Wavelength: 620nm; Package Quantity: 1; Illumination Color: Red; Test Current: 20mA; Lens Transparency: Diffused; Length: 1.6mm; Height: 0.65mm; Width: 0.8mm; Radiation Hardening: No; REACH SVHC: No SVHC; Lead Free: Lead Free; ComponentLink1URL: https://datasheet.ciiva.com/11774/0900766b80df3ada-11774020.pdf?src-supplier=RSComponents; ComponentLink1Description: https://datasheet.ciiva.com/11774/0900766b80df3ada-11774020.pdf?src-supplier=RSComponents; ComponentLink2URL: https://datasheet.ciiva.com/2110/sml-d1-2110375.pdf?src-supplier=Digi-Key; ComponentLink2Description: https://datasheet.ciiva.com/2110/sml-d1-2110375.pdf?src-supplier=Digi-Key; ComponentLink3URL: https://datasheet.ciiva.com/2110/sml-d1-2110376.pdf?src-supplier=Digi-Key; ComponentLink3Description: https://datasheet.ciiva.com/2110/sml-d1-2110376.pdf?src-supplier=Digi-Key; ComponentLink4URL: https://datasheet.ciiva.com/2110/sml-d1-2110377.pdf?src-supplier=Digi-Key; ComponentLink4Description: https://datasheet.ciiva.com/2110/sml-d1-2110377.pdf?src-supplier=Digi-Key; ComponentLink5URL: https://datasheet.ciiva.com/9324/sml-d1-9324826.pdf?src-supplier=Avnet; ComponentLink5Description: https://datasheet.ciiva.com/9324/sml-d1-9324826.pdf?src-supplier=Avnet; ComponentLink6URL: https://datasheet.ciiva.com/17420/sml-d1-17420939.pdf?src-supplier=Avnet+Europe; ComponentLink6Description: https://datasheet.ciiva.com/17420/sml-d1-17420939.pdf?src-supplier=Avnet+Europe; Supplier 1: Digi-Key; Manufacturer Part Number 1: SML-D12U8WT86; Stock 1: 63748; Pricing 1: 1=0.33000, 10=0.23900, 100=0.11340, 500=0.07560, 1000=0.05922 (USD); Supplier Part Number 1: 511-1580-1-ND
D2 D4 = SML-D12D8WT86: LED ORANGE DIFFUSED 0603 SMD Orange 605nm LED Indication - Discrete 2.2V 0603 (1608 Metric); Manufacturer 1: Rohm; Lens Color: White; Lens Style: Diffused,Colorless,Rectangular; Number of LEDs: 1; Viewing Angle: 160°; Forward Current: 20mA; Luminous Intensity: 100mcd; Supplier 1: Digi-Key; Stock 1: 29355; Pricing 1: 1=0.33000, 10=0.23900, 100=0.11340, 500=0.07560, 1000=0.05922 (USD); RoHS: Yes; Mount: Surface Mount; Case/Package: 0603; Number of Pins: 2; Color: Orange; Case Code (Metric): 1608; Case Code (Imperial): 0603; Min Operating Temperature: -40°C; Max Operating Temperature: 85°C; Dominant Wavelength: 605nm; Forward Voltage: 2.2V; Package Quantity: 1; Packaging: Tape and Reel; Illumination Color: Orange; Test Current: 20mA; Lens Transparency: Diffused; Wavelength: 605nm; Length: 1.6mm; Height: 0.65mm; Width: 0.8mm; Radiation Hardening: No; REACH SVHC: Unknown; Lead Free: Lead Free; ComponentLink1URL: https://datasheet.ciiva.com/2115/sml-d1-2115577.pdf?src-supplier=Digi-Key; ComponentLink1Description: https://datasheet.ciiva.com/2115/sml-d1-2115577.pdf?src-supplier=Digi-Key; ComponentLink2URL: https://datasheet.ciiva.com/2115/sml-d1-2115578.pdf?src-supplier=Digi-Key; ComponentLink2Description: https://datasheet.ciiva.com/2115/sml-d1-2115578.pdf?src-supplier=Digi-Key; ComponentLink3URL: https://datasheet.ciiva.com/3161/sml-d1-3161418.pdf?src-supplier=Avnet; ComponentLink3Description: https://datasheet.ciiva.com/3161/sml-d1-3161418.pdf?src-supplier=Avnet; ComponentLink4URL: https://datasheet.ciiva.com/16387/sml-d1-16387850.pdf?src-supplier=Future+Electronics; ComponentLink4Description: https://datasheet.ciiva.com/16387/sml-d1-16387850.pdf?src-supplier=Future+Electronics; ComponentLink5URL: https://datasheet.ciiva.com/2115/sml-d1-2115579.pdf?src-supplier=Digi-Key; ComponentLink5Description: https://datasheet.ciiva.com/2115/sml-d1-2115579.pdf?src-supplier=Digi-Key; ComponentLink6URL: https://datasheet.ciiva.com/17419/sml-d1-17419886.pdf?src-supplier=Avnet+Europe; ComponentLink6Description: https://datasheet.ciiva.com/17419/sml-d1-17419886.pdf?src-supplier=Avnet+Europe; Supplier Part Number 1: 511-1577-1-ND; Manufacturer Part Number 1: SML-D12D8WT86
J1 = DF40HC(3.0)-100DS-0.4V_SoM-PRO_A: CONN RCPT 100POS 0.4MM SMD GOLD; Manufacturer 1: Hirose; Manufacturer Part Number 1: DF40HC(3.0)-100DS-0.4V(58); Number of Positions: 100; Pitch: 0.016inch; System: Connector; RoHS: Yes; Mount: Surface Mount; Contact Plating: Gold; Packaging: Tape and Reel; Number of Rows: 2; Package Quantity: 1000; Connector Type: Receptacle; Lead Free: Lead Free; ComponentLink1URL: https://datasheet.ciiva.com/46636/ed-df40-20140305-46636517.pdf?src-supplier=Digi-Key; ComponentLink1Description: https://datasheet.ciiva.com/46636/ed-df40-20140305-46636517.pdf?src-supplier=Digi-Key; ComponentLink2URL: https://datasheet.ciiva.com/18562/ed-df40-20140305-18562189.pdf?src-supplier=Digi-Key; ComponentLink2Description: https://datasheet.ciiva.com/18562/ed-df40-20140305-18562189.pdf?src-supplier=Digi-Key; ComponentLink3URL: https://datasheet.ciiva.com/13559/ed-df40-20140305-13559540.pdf?src-supplier=Mouser; ComponentLink3Description: https://datasheet.ciiva.com/13559/ed-df40-20140305-13559540.pdf?src-supplier=Mouser; ComponentLink4URL: https://datasheet.ciiva.com/18562/ed-df40-20140305-18562462.pdf?src-supplier=Digi-Key; ComponentLink4Description: https://datasheet.ciiva.com/18562/ed-df40-20140305-18562462.pdf?src-supplier=Digi-Key; Supplier 1: Mouser; Stock 1: 2172; Pricing 1: 1=2.54000, 10=2.26000, 25=2.07000, 50=2.07000, 100=1.98000, 250=1.79000, 500=1.65000, 1000=1.41000, 3000=1.32000, 6000=1.23000, 10000=1.23000 (USD); Supplier 2: Mouser; Stock 2: 2078; Pricing 2: 1=2.50000, 10=2.40000, 25=2.10000, 50=2.10000, 100=2.00000, 250=1.76000, 500=1.71000, 1000=1.45000, 2000=1.36000, 5000=1.31000, 10000=1.31000 (USD); Supplier Part Number 1: 798-DF40HC30100DS451; Supplier Part Number 2: 798-DF40HC30100DS458
J4 J5 = 20021121-00010T1LF: CONN HEADER SMD 10POS 1.27MM; Manufacturer 1: Amphenol FCI; Number of Contacts: 10; Contact Resistance: 30mR; Max Voltage Rating (AC): 125V; Connector Type: Male Pin; Row Spacing: 0.05inch; Supplier 1: Digi-Key; Manufacturer Part Number 1: 20021121-00010T1LF; Stock 1: 1465; Pricing 1: 1=0.77000, 10=0.71800, 100=0.55040, 500=0.47860, 1000=0.39485, 5000=0.34699, 10000=0.32306 (USD); RoHS: Yes; Mount: Surface Mount; Contact Plating: Gold; Color: Black; Contact Material: Copper Alloy; Housing Color: Black; Housing Material: Thermoplastic; Min Operating Temperature: -40°C; Max Operating Temperature: 85°C; Number of Rows: 2; Termination: Solder; Package Quantity: 93; Packaging: Rail/Tube; Number of Positions: 10; Orientation: Straight; Length: 6.35mm; Pitch: 1.27mm; Contact Mating Length: 0.12inch; Depth: 3.4mm; ComponentLink1URL: https://datasheet.ciiva.com/18659/20021121-18659066.pdf?src-supplier=Digi-Key; ComponentLink1Description: https://datasheet.ciiva.com/18659/20021121-18659066.pdf?src-supplier=Digi-Key; ComponentLink2URL: https://datasheet.ciiva.com/10033/20021121-10033582.pdf?src-supplier=Avnet; ComponentLink2Description: https://datasheet.ciiva.com/10033/20021121-10033582.pdf?src-supplier=Avnet; Supplier Part Number 1: 609-6529-ND; Supplier 2: Mouser; Supplier 3: TTI; Supplier Part Number 2: 649-200211210010T1LF; Supplier Part Number 3: 20021121-00010T1LF
J13 = SM07B-GHS-TB(LF)(SN): Conn Shrouded Header HDR 7 POS 1.25mm Solder RA Side Entry SMD T/R; Manufacturer 1: JST; Connector Type: Outer Shroud Contact; Current Rating: 1A; Voltage Rating (AC): 50V; Number of Positions: 7; Wire/Cable Gauge: 26AWG; Pitch: 0.049inch; Supplier 1: Digi-Key; Manufacturer Part Number 1: SM07B-GHS-TB(LF)(SN); RoHS: Yes; Category: Headers and Wire Housings; Stock 1: 13; Pricing 1: 1=0.55000, 10=0.51400, 100=0.39440, 500=0.34298, 1000=0.28295 (USD); Mount: Surface Mount; Color: Natural; Contact Plating: Tin; Contact Material: Bronze; Housing Material: Nylon; Housing Color: Natural; Min Operating Temperature: -25°C; Max Operating Temperature: 85°C; Number of Rows: 1; Fastening Type: Ramp; Packaging: Cut Tape; Termination: Solder; Number of Contacts: 7; REACH SVHC: Unknown; Lead Free: Lead Free; ComponentLink1URL: https://datasheet.ciiva.com/712/egh-712501.pdf?src-supplier=Digi-Key; ComponentLink1Description: https://datasheet.ciiva.com/712/egh-712501.pdf?src-supplier=Digi-Key; ComponentLink2URL: https://datasheet.ciiva.com/730/egh-730606.pdf?src-supplier=Digi-Key; ComponentLink2Description: https://datasheet.ciiva.com/730/egh-730606.pdf?src-supplier=Digi-Key; ComponentLink3URL: https://datasheet.ciiva.com/22728/5438-22728669.pdf?src-supplier=Element14; ComponentLink3Description: https://datasheet.ciiva.com/22728/5438-22728669.pdf?src-supplier=Element14
M1 M3 = RE1C002UNTCL: MOSFET N-CH 20V 0.2A EMT3; Manufacturer 1: Rohm; Continuous Drain Current (ID): 200mA; Rds On Max: 1.2R; Input Capacitance: 25pF; Max Power Dissipation: 150mW; RoHS: Yes; Mount: Surface Mount; Case/Package: SOT-89; Packaging: Tape and Reel; Drain to Source Voltage (Vdss): 20V; Lead Free: Lead Free; ComponentLink1URL: http://www.mouser.com/ds/2/348/re1c002untcl-e-1018231.pdf?src-supplier=Mouser; ComponentLink1Description: http://www.mouser.com/ds/2/348/re1c002untcl-e-1018231.pdf?src-supplier=Mouser; ComponentLink2URL: http://rohmfs.rohm.com/en/techdata_basic/transistor/taping/EMT3_TL_taping.pdf?src-supplier=Digi-Key; ComponentLink2Description: http://rohmfs.rohm.com/en/techdata_basic/transistor/taping/EMT3_TL_taping.pdf?src-supplier=Digi-Key; ComponentLink3URL: http://rohmfs.rohm.com/en/products/databook/datasheet/discrete/transistor/mosfet/re1c002un.pdf?src-supplier=Avnet; ComponentLink3Description: http://rohmfs.rohm.com/en/products/databook/datasheet/discrete/transistor/mosfet/re1c002un.pdf?src-supplier=Avnet; ComponentLink4URL: https://www.rohm.com/datasheet/RE1C002UN/re1c002untcl-e?src-supplier=Digi-Key; ComponentLink4Description: https://www.rohm.com/datasheet/RE1C002UN/re1c002untcl-e?src-supplier=Digi-Key; ComponentLink5URL: http://www.farnell.com/datasheets/2704376.pdf?src-supplier=Newark; ComponentLink5Description: http://www.farnell.com/datasheets/2704376.pdf?src-supplier=Newark; ComponentLink6URL: http://www.farnell.com/datasheets/2704376.pdf?src-supplier=Farnell; ComponentLink6Description: http://www.farnell.com/datasheets/2704376.pdf?src-supplier=Farnell; ComponentLink7URL: http://www.farnell.com/datasheets/2704376.pdf?src-supplier=Element14; ComponentLink7Description: http://www.farnell.com/datasheets/2704376.pdf?src-supplier=Element14; Supplier 1: Digi-Key; Manufacturer Part Number 1: RE1C002UNTCL; Stock 1: 868886; Pricing 1: 1=0.20000, 10=0.18200, 100=0.09930, 500=0.06112, 1000=0.04167 (USD); Supplier Part Number 1: RE1C002UNTCLCT-ND
R3 R4 R15 R26 = RC0402FR-071KL: RES SMD 1K OHM 1% 1/16W 0402 1 kOhms ±1% 0.063W, 1/16W Chip Resistor 0402 (1005 Metric) Moisture Resistant Thick Film; Manufacturer 1: Yageo; Temperature Coefficient: 100ppm/°C; Power Rating: 62.5mW; Voltage Rating (DC): 50V; Resistance: 1kR; RoHS: Yes; Number of Pins: 2; Case Code (Imperial): 0402; Case Code (Metric): 1005; Min Operating Temperature: -55°C; Max Operating Temperature: 155°C; Packaging: Tape and Reel; Composition: Thick Film; Voltage Rating: 50V; Military Standard: Not; Termination: SMD/SMT; Length: 1mm; Height: 0.32mm; Width: 0.5mm; Depth: 0.5mm; Lead Free: Lead Free; REACH SVHC: Unknown; ComponentLink1URL: https://datasheet.ciiva.com/11819/0900766b80c66297-11819477.pdf?src-supplier=RSComponents; ComponentLink1Description: https://datasheet.ciiva.com/11819/0900766b80c66297-11819477.pdf?src-supplier=RSComponents; ComponentLink2URL: https://datasheet.ciiva.com/12666/pyu-rc0402-51-rohs-l-6-r-12666741.pdf?src-supplier=Mouser; ComponentLink2Description: https://datasheet.ciiva.com/12666/pyu-rc0402-51-rohs-l-6-r-12666741.pdf?src-supplier=Mouser; ComponentLink3URL: https://datasheet.ciiva.com/17063/pyu-rc0402-51-rohs-l-6-r-17063193.pdf?src-supplier=Future+Electronics; ComponentLink3Description: https://datasheet.ciiva.com/17063/pyu-rc0402-51-rohs-l-6-r-17063193.pdf?src-supplier=Future+Electronics; ComponentLink4URL: https://datasheet.ciiva.com/22747/1018594-22747513.pdf?src-supplier=Element14; ComponentLink4Description: https://datasheet.ciiva.com/22747/1018594-22747513.pdf?src-supplier=Element14; ComponentLink5URL: https://datasheet.ciiva.com/7849/1018594-7849869.pdf?src-supplier=Element14; ComponentLink5Description: https://datasheet.ciiva.com/7849/1018594-7849869.pdf?src-supplier=Element14; ComponentLink6URL: https://datasheet.ciiva.com/7983/1018594-7983502.pdf?src-supplier=Element14; ComponentLink6Description: https://datasheet.ciiva.com/7983/1018594-7983502.pdf?src-supplier=Element14; ComponentLink7URL: https://datasheet.ciiva.com/7849/1018594-7849871.pdf?src-supplier=Element14; ComponentLink7Description: https://datasheet.ciiva.com/7849/1018594-7849871.pdf?src-supplier=Element14; Supplier 1: Digi-Key; Manufacturer Part Number 1: RC0402FR-071KL; Stock 1: 60695854; Pricing 1: 1=0.10000, 10=0.01600, 100=0.00670, 1000=0.00301, 2500=0.00261, 5000=0.00215 (USD); Case/Package: 0402; Tolerance: 1%; Supplier Part Number 1: 311-1.00KLRCT-ND
R7 R43 = CMP-013-000022-3: RES SMD 0 OHM JUMPER 1/16W 0402; Manufacturer 1: Vishay; Max Power Dissipation: 63mW; Voltage Rating: 50V; Resistance: 0mR; Tolerance: 5%; Design Item ID: CRCW04020000Z0ED; Min Operating Temperature: -55°C; Case Code (Imperial): 0402; Manufacturer Part Number 1: CRCW04020000Z0ED; Case Code (Metric): 1005; Power Rating: 63mW; Length: 1mm; Max Operating Temperature: 155°C; Height: 0.35mm; Case/Package: 0402; Depth: 0.5mm
R10 = RC0402FR-0722RL: RES SMD 22 OHM 1% 1/16W 0402; Manufacturer 1: Yageo; Temperature Coefficient: 100ppm/°C; Power Rating: 63mW; Voltage Rating: 50V; Supplier 1: Digi-Key; Manufacturer Part Number 1: RC0402FR-0722RL; Stock 1: 23751364; Pricing 1: 10000=0.00163, 30000=0.00144, 50000=0.00132, 100000=0.00129 (USD); RoHS: Yes; Case/Package: 0402; Number of Pins: 2; Case Code (Metric): 1005; Case Code (Imperial): 0402; Min Operating Temperature: -55°C; Max Operating Temperature: 155°C; Tolerance: 1%; Resistance: 22R; Packaging: Tape and Reel; Composition: Thick Film; Voltage Rating (DC): 50V; Termination: SMD/SMT; Military Standard: Not; Length: 1mm; Height: 0.32mm; Width: 0.5mm; Depth: 0.5mm; REACH SVHC: Unknown; Lead Free: Lead Free; ComponentLink1URL: https://datasheet.ciiva.com/11819/0900766b80c66297-11819462.pdf?src-supplier=RSComponents; ComponentLink1Description: https://datasheet.ciiva.com/11819/0900766b80c66297-11819462.pdf?src-supplier=RSComponents; ComponentLink2URL: https://datasheet.ciiva.com/7849/1018594-7849911.pdf?src-supplier=Element14; ComponentLink2Description: https://datasheet.ciiva.com/7849/1018594-7849911.pdf?src-supplier=Element14; ComponentLink3URL: https://datasheet.ciiva.com/26829/getdatasheetpartid-554995-26829991.pdf?src-supplier=Verical; ComponentLink3Description: https://datasheet.ciiva.com/26829/getdatasheetpartid-554995-26829991.pdf?src-supplier=Verical; ComponentLink4URL: https://datasheet.ciiva.com/7849/1018594-7849912.pdf?src-supplier=Element14; ComponentLink4Description: https://datasheet.ciiva.com/7849/1018594-7849912.pdf?src-supplier=Element14; ComponentLink5URL: https://datasheet.ciiva.com/16930/pyu-rc0402-51-rohs-l-6-r-16930687.pdf?src-supplier=Future+Electronics; ComponentLink5Description: https://datasheet.ciiva.com/16930/pyu-rc0402-51-rohs-l-6-r-16930687.pdf?src-supplier=Future+Electronics; Supplier 2: Newark; Supplier 3: Mouser; Supplier Part Number 2: 26M6784; Supplier Part Number 3: 603-RC0402FR-0722RL; Supplier Part Number 1: 311-22.0LRTR-ND
R27 = CRCW06030000Z0EA: RES SMD 0 OHM JUMPER 1/10W 0603 0 Ohms Jumper 0.1W, 1/10W Chip Resistor 0603 (1608 Metric) Automotive AEC-Q200 Thick Film; Manufacturer 1: Vishay; Manufacturer Part Number 1: CRCW0603-0000Z0EA; Resistance: 0mR; Power Rating: 100mW; Voltage Rating: 75V; Temperature Coefficient: 100ppm/°C; Tolerance: 5%; Current Rating: 2A; Supplier 1: Digi-Key; Stock 1: 742743; Pricing 1: 1=0.100000, 10=0.034000, 25=0.024400, 50=0.018600, 100=0.013800, 250=0.010480, 500=0.008400, 1000=0.006180 (USD); RoHS: Yes; Mount: Surface Mount; Case/Package: 0603; Weight: 7.1E-05oz; Contact Plating: Tin,Lead; Case Code (Metric): 1608; Case Code (Imperial): 0603; Min Operating Temperature: -55°C; Max Operating Temperature: 155°C; Composition: Thick Film; Termination: SMD/SMT; Packaging: Tape and Reel; Package Quantity: 1; Number of Terminations: 2; Military Standard: Not; Max Power Dissipation: 100mW; Voltage Rating (DC): 75V; Features: Automotive AEC-Q200; Working Voltage: 75V; Length: 1.55mm; Height: 0.02inch; Width: 0.033inch; Depth: 0.85mm; Radiation Hardening: No; Lead Free: Lead Free; REACH SVHC: Unknown; ComponentLink1URL: https://datasheet.ciiva.com/2461/dcrcwe3-2461968.pdf?src-supplier=Digi-Key; ComponentLink1Description: https://datasheet.ciiva.com/2461/dcrcwe3-2461968.pdf?src-supplier=Digi-Key; ComponentLink2URL: https://datasheet.ciiva.com/2461/dcrcwe3-2461969.pdf?src-supplier=Digi-Key; ComponentLink2Description: https://datasheet.ciiva.com/2461/dcrcwe3-2461969.pdf?src-supplier=Digi-Key; ComponentLink3URL: https://datasheet.ciiva.com/2461/dcrcwe3-2461970.pdf?src-supplier=Digi-Key; ComponentLink3Description: https://datasheet.ciiva.com/2461/dcrcwe3-2461970.pdf?src-supplier=Digi-Key; ComponentLink4URL: https://datasheet.ciiva.com/8340/dcrcwe3-8340197.pdf?src-supplier=Avnet; ComponentLink4Description: https://datasheet.ciiva.com/8340/dcrcwe3-8340197.pdf?src-supplier=Avnet; ComponentLink5URL: https://datasheet.ciiva.com/16941/dcrcw-16941302.pdf?src-supplier=Avnet+Europe; ComponentLink5Description: https://datasheet.ciiva.com/16941/dcrcw-16941302.pdf?src-supplier=Avnet+Europe; ComponentLink6URL: https://datasheet.ciiva.com/16199/dcrcwe3-16199063.pdf?src-supplier=Future+Electronics; ComponentLink6Description: https://datasheet.ciiva.com/16199/dcrcwe3-16199063.pdf?src-supplier=Future+Electronics; ComponentLink7URL: https://datasheet.ciiva.com/16725/70201119-16725175.pdf?src-supplier=Allied+Electronics; ComponentLink7Description: https://datasheet.ciiva.com/16725/70201119-16725175.pdf?src-supplier=Allied+Electronics; ComponentLink8URL: https://datasheet.ciiva.com/26316/fld-crcw-e3-data-en-26316615.pdf?src-supplier=Distrelec; ComponentLink8Description: https://datasheet.ciiva.com/26316/fld-crcw-e3-data-en-26316615.pdf?src-supplier=Distrelec; ComponentLink9URL: https://datasheet.ciiva.com/5544/dcrcwe3-109170-5544344.pdf?src-supplier=Mouser; ComponentLink9Description: https://datasheet.ciiva.com/5544/dcrcwe3-109170-5544344.pdf?src-supplier=Mouser; ComponentLink10URL: https://datasheet.ciiva.com/7841/1720486-7841816.pdf?src-supplier=Element14; ComponentLink10Description: https://datasheet.ciiva.com/7841/1720486-7841816.pdf?src-supplier=Element14; ComponentLink11URL: https://datasheet.ciiva.com/7841/1720486-7841817.pdf?src-supplier=Element14; ComponentLink11Description: https://datasheet.ciiva.com/7841/1720486-7841817.pdf?src-supplier=Element14; ComponentLink12URL: https://datasheet.ciiva.com/7841/125364-7841818.pdf?src-supplier=Element14; ComponentLink12Description: https://datasheet.ciiva.com/7841/125364-7841818.pdf?src-supplier=Element14; ComponentLink13URL: https://datasheet.ciiva.com/16721/70201119-16721450.pdf?src-supplier=Allied+Electronics; ComponentLink13Description: https://datasheet.ciiva.com/16721/70201119-16721450.pdf?src-supplier=Allied+Electronics; Supplier Part Number 1: 541-0.0GCT-ND